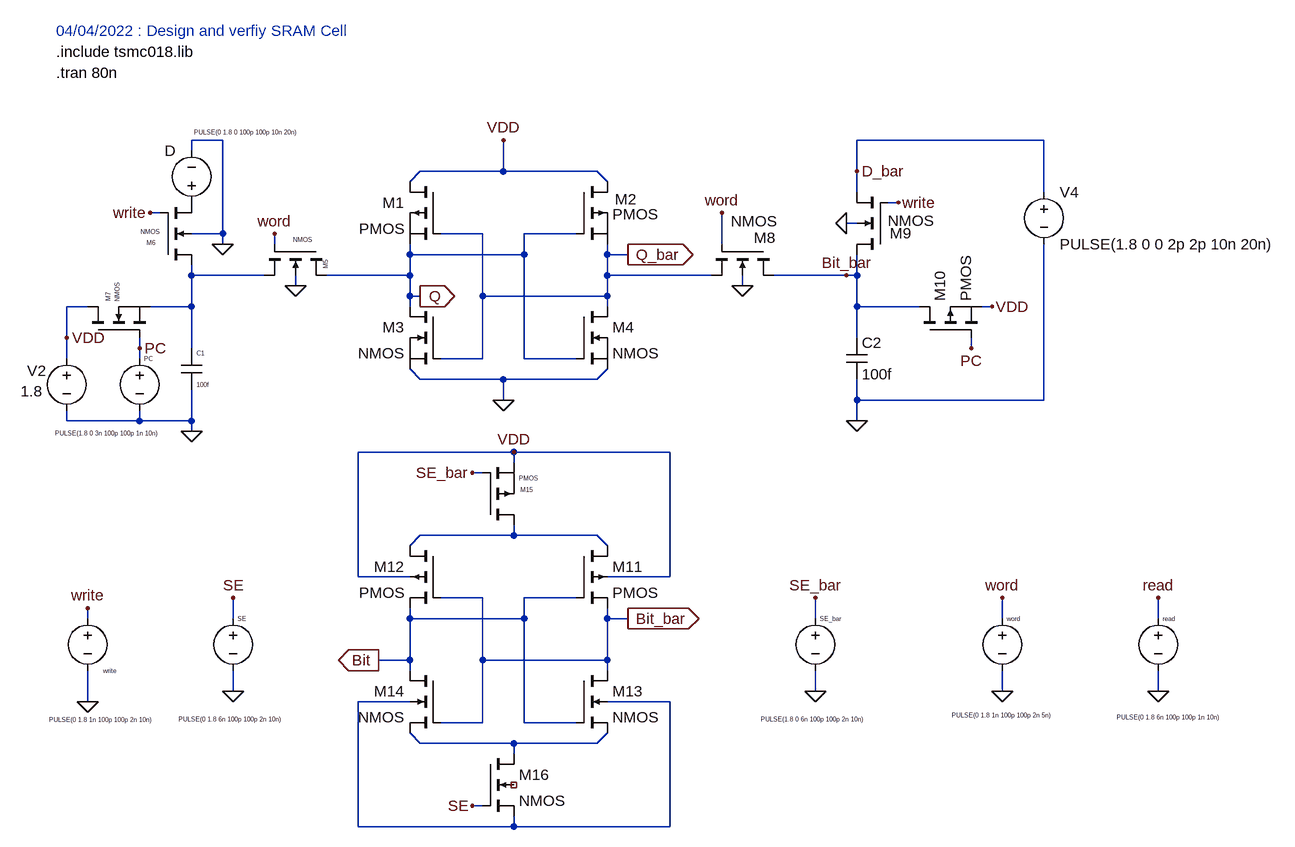
[diagram p0: schematic SRAM_Cell.asc]
SRAM_Cell.asc, the LTspice schematic file:
Version 4
SHEET 1 1032 1228
WIRE -608 144 -656 144
WIRE 656 144 368 144
WIRE -656 160 -656 144
WIRE -176 192 -176 144
WIRE -176 192 -304 192
WIRE -32 192 -176 192
WIRE 368 192 368 144
WIRE -320 208 -304 192
WIRE -16 208 -32 192
WIRE 368 224 368 192
WIRE 656 224 656 144
WIRE 432 240 416 240
WIRE -704 256 -720 256
WIRE 368 272 352 272
WIRE -608 288 -608 144
WIRE -608 288 -656 288
WIRE -208 288 -272 288
WIRE -64 288 -144 288
WIRE -608 304 -608 288
WIRE -528 304 -528 288
WIRE 160 304 160 256
WIRE -320 320 -320 304
WIRE -144 320 -144 288
WIRE -144 320 -320 320
WIRE -16 320 -16 304
WIRE 16 320 -16 320
WIRE -656 352 -656 336
WIRE -544 352 -656 352
WIRE -320 352 -320 320
WIRE -320 352 -448 352
WIRE -16 352 -16 320
WIRE 144 352 -16 352
WIRE 352 352 240 352
WIRE 368 352 368 320
WIRE 368 352 352 352
WIRE -496 368 -496 352
WIRE 192 368 192 352
WIRE -320 384 -320 352
WIRE -304 384 -320 384
WIRE -208 384 -208 288
WIRE -16 384 -16 352
WIRE -16 384 -208 384
WIRE -816 400 -848 400
WIRE -656 400 -656 352
WIRE -656 400 -720 400
WIRE -320 400 -320 384
WIRE -16 400 -16 384
WIRE 368 400 368 352
WIRE 464 400 368 400
WIRE 576 400 560 400
WIRE -848 448 -848 400
WIRE 368 448 368 400
WIRE -736 464 -736 448
WIRE -656 464 -656 400
WIRE 544 464 544 448
WIRE -848 480 -848 448
WIRE -736 480 -736 464
WIRE -208 480 -208 384
WIRE -208 480 -272 480
WIRE -144 480 -144 320
WIRE -64 480 -144 480
WIRE -304 512 -320 496
WIRE -176 512 -304 512
WIRE -32 512 -16 496
WIRE -32 512 -176 512
WIRE -176 544 -176 512
WIRE 368 544 368 512
WIRE 656 544 656 304
WIRE 656 544 368 544
WIRE -848 576 -848 560
WIRE -736 576 -736 560
WIRE -736 576 -848 576
WIRE -656 576 -656 528
WIRE -656 576 -736 576
WIRE 368 576 368 544
WIRE -656 592 -656 576
WIRE -160 624 -400 624
WIRE 80 624 -160 624
WIRE -160 640 -160 624
WIRE -208 656 -224 656
WIRE -160 752 -160 736
WIRE -160 752 -304 752
WIRE -32 752 -160 752
WIRE -320 768 -304 752
WIRE -16 768 -32 752
WIRE -400 816 -400 624
WIRE -320 816 -400 816
WIRE 80 816 80 624
WIRE 80 816 -16 816
WIRE -208 848 -272 848
WIRE -64 848 -144 848
WIRE -816 880 -816 864
WIRE -592 880 -592 848
WIRE -320 880 -320 864
WIRE -144 880 -144 848
WIRE -144 880 -320 880
WIRE -16 880 -16 864
WIRE 16 880 -16 880
WIRE 304 880 304 848
WIRE 592 880 592 848
WIRE 832 880 832 848
WIRE -320 944 -320 880
WIRE -320 944 -368 944
WIRE -208 944 -208 848
WIRE -16 944 -16 880
WIRE -16 944 -208 944
WIRE -320 960 -320 944
WIRE -16 960 -16 944
WIRE -592 992 -592 960
WIRE 304 992 304 960
WIRE 592 992 592 960
WIRE 832 992 832 960
WIRE -816 1008 -816 960
WIRE -320 1008 -400 1008
WIRE 80 1008 -16 1008
WIRE -208 1040 -208 944
WIRE -208 1040 -272 1040
WIRE -144 1040 -144 880
WIRE -64 1040 -144 1040
WIRE -304 1072 -320 1056
WIRE -160 1072 -304 1072
WIRE -32 1072 -16 1056
WIRE -32 1072 -160 1072
WIRE -160 1088 -160 1072
WIRE -208 1168 -224 1168
WIRE -400 1200 -400 1008
WIRE -160 1200 -160 1184
WIRE -160 1200 -400 1200
WIRE 80 1200 80 1008
WIRE 80 1200 -160 1200
FLAG -176 144 VDD
FLAG -176 544 0
FLAG -304 384 Q
IOPIN -304 384 Out
FLAG 16 320 Q_bar
IOPIN 16 320 Out
FLAG -528 288 word
FLAG -496 368 0
FLAG -656 592 0
FLAG -720 256 write
FLAG 192 368 0
FLAG 160 256 word
FLAG 352 272 0
FLAG 432 240 write
FLAG 368 576 0
FLAG 576 400 VDD
FLAG 544 464 PC
FLAG -160 624 VDD
FLAG -368 944 Bit
IOPIN -368 944 Out
FLAG 16 880 Bit_bar
IOPIN 16 880 Out
FLAG -224 656 SE_bar
FLAG -224 1168 SE
FLAG -608 304 0
FLAG -848 448 VDD
FLAG -736 464 PC
FLAG 352 352 Bit_bar
FLAG 368 192 D_bar
FLAG -592 992 0
FLAG -592 848 SE
FLAG 304 992 0
FLAG 304 848 SE_bar
FLAG 592 992 0
FLAG 592 848 word
FLAG 832 992 0
FLAG 832 848 read
FLAG -816 1008 0
FLAG -816 864 write
SYMBOL pmos -272 208 M0
SYMATTR InstName M1
SYMBOL pmos -64 208 R0
WINDOW 0 60 27 Left 2
WINDOW 3 56 50 Left 2
SYMATTR InstName M2
SYMBOL nmos -272 400 M0
SYMATTR InstName M3
SYMBOL nmos -64 400 R0
SYMATTR InstName M4
SYMBOL nmos4 -448 304 R90
WINDOW 0 24 1 Left 0
WINDOW 3 -7 22 VRight 0
SYMATTR InstName M5
SYMBOL nmos4 -704 336 M180
WINDOW 0 -21 34 Left 0
WINDOW 3 -30 51 Left 0
SYMATTR InstName M6
SYMBOL cap -672 464 R0
WINDOW 0 24 8 Left 0
WINDOW 3 24 56 Left 0
SYMATTR InstName C1
SYMATTR Value 100f
SYMBOL voltage -656 256 R180
WINDOW 0 24 96 Left 2
WINDOW 3 -164 124 Left 0
WINDOW 123 0 0 Left 0
WINDOW 39 0 0 Left 0
SYMATTR InstName D
SYMATTR Value PULSE(0 1.8 0 100p 100p 10n 20n)
SYMBOL nmos -816 448 R270
WINDOW 0 56 32 Left 0
WINDOW 3 55 46 Left 0
SYMATTR InstName M7
SYMBOL voltage -848 464 R0
WINDOW 0 -46 50 Bottom 2
WINDOW 3 -54 51 Top 2
WINDOW 123 0 0 Left 0
WINDOW 39 0 0 Left 0
SYMATTR InstName V2
SYMATTR Value 1.8
SYMBOL voltage -736 464 R0
WINDOW 0 7 16 Left 0
WINDOW 3 -130 131 Left 0
WINDOW 123 0 0 Left 0
WINDOW 39 0 0 Left 0
SYMATTR InstName PC
SYMATTR Value PULSE(1.8 0 3n 100p 100p 1n 10n)
SYMBOL nmos4 240 304 R90
WINDOW 0 -10 -3 VRight 2
WINDOW 3 -35 -6 VRight 2
SYMATTR InstName M8
SYMBOL nmos4 416 320 R180
WINDOW 0 -3 33 Right 2
WINDOW 3 0 52 Right 2
SYMATTR InstName M9
SYMBOL voltage 656 208 R0
WINDOW 123 0 0 Left 0
WINDOW 39 0 0 Left 0
SYMATTR InstName V4
SYMATTR Value PULSE(1.8 0 0 2p 2p 10n 20n)
SYMBOL cap 352 448 R0
SYMATTR InstName C2
SYMATTR Value 100f
SYMBOL pmos 464 448 R270
SYMATTR InstName M10
SYMBOL pmos4 -64 768 R0
SYMATTR InstName M11
SYMBOL pmos4 -272 768 M0
SYMATTR InstName M12
SYMBOL pmos -208 736 M180
WINDOW 0 58 54 Left 0
WINDOW 3 56 72 Left 0
SYMATTR InstName M15
SYMBOL nmos4 -64 960 R0
SYMATTR InstName M13
SYMBOL nmos4 -272 960 M0
SYMATTR InstName M14
SYMBOL nmos4 -208 1088 R0
SYMATTR InstName M16
SYMBOL voltage -816 864 R0
WINDOW 0 24 96 Left 0
WINDOW 3 -59 172 Left 0
WINDOW 123 0 0 Left 0
WINDOW 39 0 0 Left 0
SYMATTR InstName write
SYMATTR Value PULSE(0 1.8 1n 100p 100p 2n 10n)
SYMBOL voltage -592 864 R0
WINDOW 0 7 16 Left 0
WINDOW 3 -84 171 Left 0
WINDOW 123 0 0 Left 0
WINDOW 39 0 0 Left 0
SYMATTR InstName SE
SYMATTR Value PULSE(0 1.8 6n 100p 100p 2n 10n)
SYMBOL voltage 304 864 R0
WINDOW 0 7 16 Left 0
WINDOW 3 -84 171 Left 0
WINDOW 123 0 0 Left 0
WINDOW 39 0 0 Left 0
SYMATTR InstName SE_bar
SYMATTR Value PULSE(1.8 0 6n 100p 100p 2n 10n)
SYMBOL voltage 592 864 R0
WINDOW 0 7 16 Left 0
WINDOW 3 -78 165 Left 0
WINDOW 123 0 0 Left 0
WINDOW 39 0 0 Left 0
SYMATTR InstName word
SYMATTR Value PULSE(0 1.8 1n 100p 100p 2n 5n)
SYMBOL voltage 832 864 R0
WINDOW 0 7 16 Left 0
WINDOW 3 -64 168 Left 0
WINDOW 123 0 0 Left 0
WINDOW 39 0 0 Left 0
SYMATTR InstName read
SYMATTR Value PULSE(0 1.8 6n 100p 100p 1n 10n)
TEXT -864 -24 Left 2 ;04/04/2022 : Design and verfiy SRAM Cell
TEXT -864 8 Left 2 !.include tsmc018.lib
TEXT -864 40 Left 2 !.tran 80n

The netlist it stands for:
* SRAM_Cell.asc
M1 VDD Q_bar Q Q PMOS
M2 VDD Q Q_bar Q_bar PMOS
M3 Q Q_bar 0 0 NMOS
M4 Q_bar Q 0 0 NMOS
M5 Q word N001 0 NMOS
M6 N001 write P001 0 NMOS
C1 N001 0 100f
V§D P001 0 PULSE(0 1.8 0 100p 100p 10n 20n)
M7 VDD PC N001 N001 NMOS
V2 VDD 0 1.8
V§PC PC 0 PULSE(1.8 0 3n 100p 100p 1n 10n)
M8 Bit_bar word Q_bar 0 NMOS
M9 Bit_bar write D_bar 0 NMOS
V4 D_bar 0 PULSE(1.8 0 0 2p 2p 10n 20n)
C2 Bit_bar 0 100f
M10 Bit_bar PC VDD VDD PMOS
M11 N002 Bit Bit_bar VDD PMOS
M12 N002 Bit_bar Bit VDD PMOS
M15 N002 SE_bar VDD VDD PMOS
M13 Bit_bar Bit N004 N003 NMOS
M14 Bit Bit_bar N004 N003 NMOS
M16 N004 SE N003 NC_01 NMOS
V§write write 0 PULSE(0 1.8 1n 100p 100p 2n 10n)
V§SE SE 0 PULSE(0 1.8 6n 100p 100p 2n 10n)
V§SE_bar SE_bar 0 PULSE(1.8 0 6n 100p 100p 2n 10n)
V§word word 0 PULSE(0 1.8 1n 100p 100p 2n 5n)
V§read read 0 PULSE(0 1.8 6n 100p 100p 1n 10n)
.model NMOS NMOS
.model PMOS PMOS
.lib standard.mos
* 04/04/2022 : Design and verfiy SRAM Cell
.include tsmc018.lib
.tran 80n
.backanno
.end